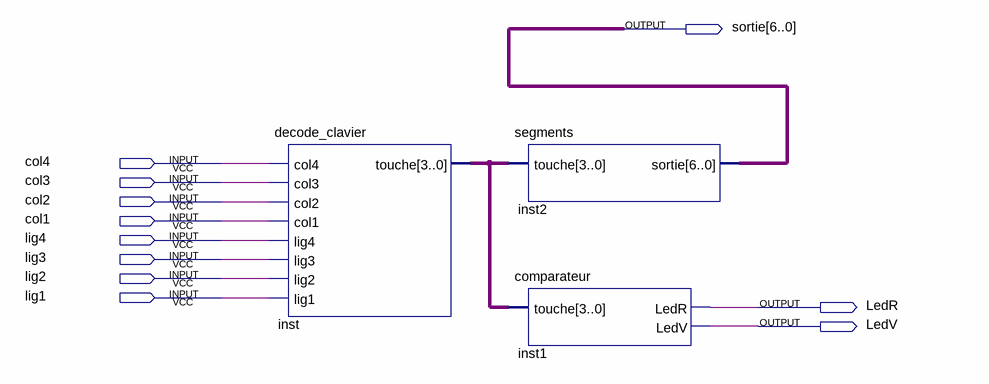
[diagram p0: schematic sheet]
// Quartus schematic serrure.bdf as structural Verilog: 3 symbols, 11 pins
module serrure (
  input  col4,
  input  col3,
  input  col2,
  input  col1,
  input  lig4,
  input  lig3,
  input  lig2,
  input  lig1,
  output [6:0] sortie,
  output LedR,
  output LedV
);

  wire [3:0] inst_touche;

  decode_clavier inst (
    .col4(col4), .col3(col3), .col2(col2), .col1(col1), .lig4(lig4), .lig3(lig3), .lig2(lig2), .lig1(lig1),
    .touche(inst_touche));
  segments inst2 (.touche(inst_touche), .sortie(sortie));
  comparateur inst1 (.touche(inst_touche), .LedR(LedR), .LedV(LedV));
endmodule
